# EAGLE design Rev1 (EAGLE 8.4.2)
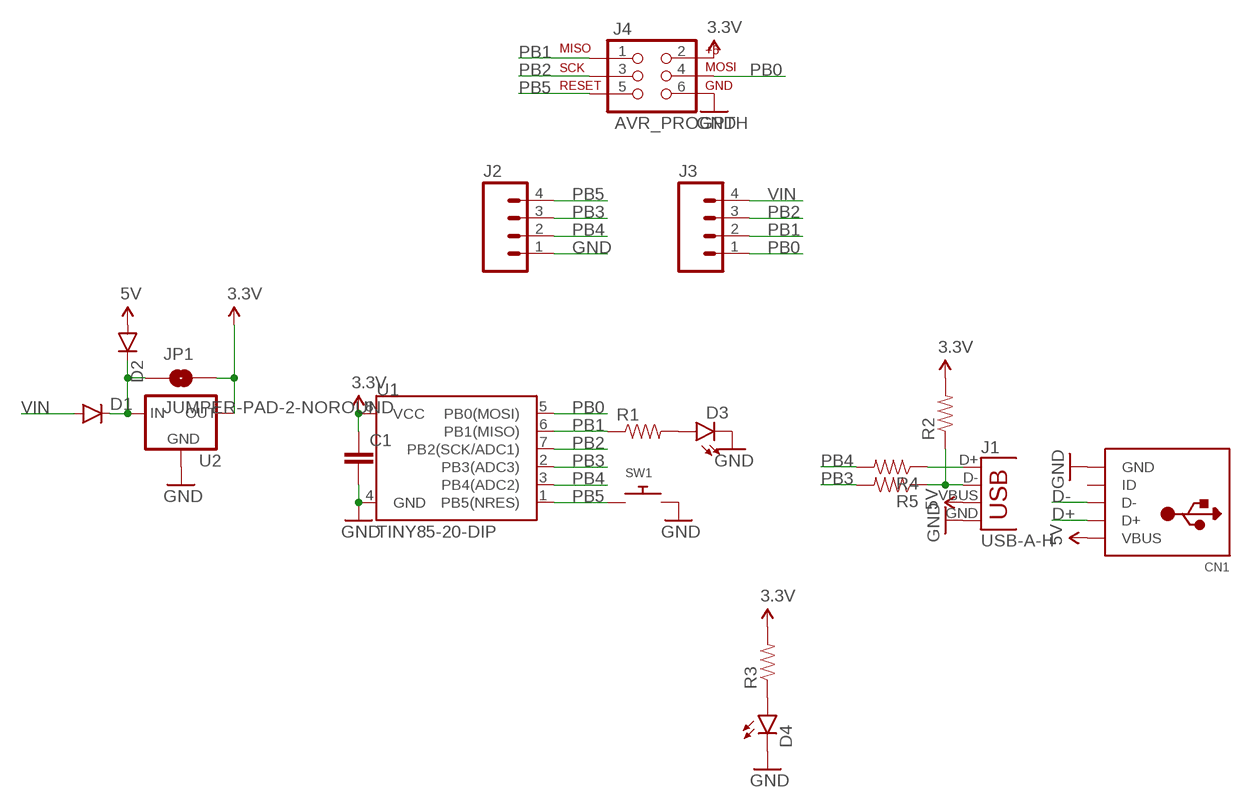
[diagram p0: schematic, sheet 1]

## Parts
C1  0.1UF-50V-20%(PTH)KIT-EZ  [CAP-PTH-SMALL-KIT]
CN1  USBTHM  [USB-MINIB-THM]
D1  DIODEPTH  [DIODE-1N4001]
D2  DIODEPTH  [DIODE-1N4001]
D3  LED3MM  [LED3MM]
D4  LED3MM  [LED3MM]
J1  USB-A-H  [USB-A-H]
J2  M04PTH  [1X04]
J3  M04PTH  [1X04]
J4  AVR_PROGPTH  [2X3]
JP1  JUMPER-PAD-2-NOROUND  [PAD-JUMPER-2-NO_YES_SILK_ROUND]
R1  RESISTORPTH-1/6W  [1/6W-RES]
R2  RESISTORPTH-1/6W  [1/6W-RES]
R3  RESISTORPTH-1/6W  [1/6W-RES]
R4  RESISTORPTH-1/6W  [1/6W-RES]
R5  RESISTORPTH-1/6W  [1/6W-RES]
SW1  SWITCH_PUSHBUTTONEVQ-PE  [TACT_PANA-EVQ]
U1  TINY85-20-DIP  ATTINY45TINY85-20-DIP  [DIP08]
U2  V_REG_78XXTO-92_UNTESTED  [TO-92]

## Nets
3.3V: C1.1 J4.2(VIN) JP1.2 R2.2 R3.2 U1.8(VCC) U2.1(OUT)
5V: CN1.VBUS D2.A J1.VBUS
D+: CN1.D+ J1.D+ R4.1
D-: CN1.D- J1.D- R2.1 R5.1
GND: C1.2 CN1.GND D3.K(C) D4.K(C) J1.GND J2.1 J4.6(GND) SW1.P$2 U1.4(GND) U2.2(GND)
N$1: D4.A R3.1
N$2: D3.A R1.2
N$3: D1.C D2.C JP1.1 U2.3(IN)
PB0: J3.1 J4.4(MOSI) U1.5(PB0(MOSI))
PB1: J3.2 J4.1(MISO) R1.1 U1.6(PB1(MISO))
PB2: J3.3 J4.3(SCK) U1.7(PB2(SCK/ADC1))
PB3: J2.3 R5.2 U1.2(PB3(ADC3))
PB4: J2.2 R4.2 U1.3(PB4(ADC2))
PB5: J2.4 J4.5(RESET) SW1.P$1 U1.1(PB5(NRES))
VIN: D1.A J3.4
Unconnected: CN1.ID

## Library data of the parts
C1 = SparkFun-Capacitors:0.1UF-50V-20%(PTH): CAP-08370; PROD_ID: CAP-08370
CN1 = adafruit:USB: USB Connectors USBMINIB - Surface Mount Female Mini-B USB Connector 4UConnector: 06564 By microbuilder.eu Thru-hole RA Female Mini-B USB Connector 4UConnector: 18732 By ladyada.net
D1 D2 = SparkFun-DiscreteSemi:DIODE: Diode These are standard reverse protection diodes and small signal diodes. SMA package can handle up to about 1A. SOD-323 can handle about 200mA. What the SOD-323 package when ordering, there are some mfgs out there that are 5-pin packages.
D3 D4 = SparkFun-LED:LED: LEDs Standard schematic elements and footprints for 5mm, 3mm, 1206, and 0603 sized LEDs. 5mm - Spark Fun Electronics SKU : COM-00529 (and others); PROD_ID: DIO-08794
J1 = SparkFun-Connectors:USB: USB Connectors USB-B-PTH is fully proven SKU : PRT-00139/CONN-08278 USB-miniB is fully proven SKU : PRT-00587 USB-A-PCB is untested. USB-A-H is throughly reviewed, but untested. Spark Fun Electronics SKU : PRT-00437 USB-B-SMT is throughly reviewed, but untested. Needs silkscreen touching up. USB-A-S has not been used/tested USB-MB-H has not been used/tested USB-MICROB has been used. CONN-09505; PROD_ID: CONN-08367
J2 J3 = SparkFun-Connectors:M04: Header 4 Standard 4-pin 0.1" header. Use with straight break away headers (SKU : PRT-00116), right angle break away headers (PRT-00553), swiss pins (PRT-00743), machine pins (PRT-00117), and female headers (PRT-00115). Molex polarized connector foot print use with SKU : PRT-08231 with associated crimp pins and housings. 1MM SMD Version SKU: PRT-10208; PROD_ID: CONN-09696
J4 = maxorig:AVR_PROG: AVR ISP 6 Pin This is the reduced ISP connector for AVR programming. Common on Arduino. This footprint will take up less PCB space and can be used with a 10-pin to 6-pin adapter such as SKU: BOB-08508 **Special note about "TEST_POINT" package. The stop mask is on the top side, so if you want your programming test points to be on the bottom of your board, make sure to place this package on the bottom side of the board. This also ensure that the orientation to program from the bottom side will be correct.
JP1 = SparkFun-Passives:JUMPER-PAD-2-NO
R1-R5 = SparkFun-Resistors:RESISTOR: Resistor Basic schematic elements and footprints for 0603, 1206, and PTH resistors.
SW1 = adafruit:SWITCH_PUSHBUTTON: Buttons SOFTTOUCHSMD_SJ - Soft touch temporary push button (Super Junk Akihabara) Compatible with SKPMANE010 [Mouser: 688-SKPMAN] C&K_KSS = Digikey: KSS221GLFS
U1 = SparkFun-DigitalIC:ATTINY45: Atmel 8-pin 2/4/8kB flash uC; PROD_ID: IC-09445
U2 = SparkFun-PowerIC:V_REG_78XX: Voltage Regulator Standard 78xx regulator. IGO (Input Ground Output). Spark Fun Electronics SKU : COM-00107

## Board
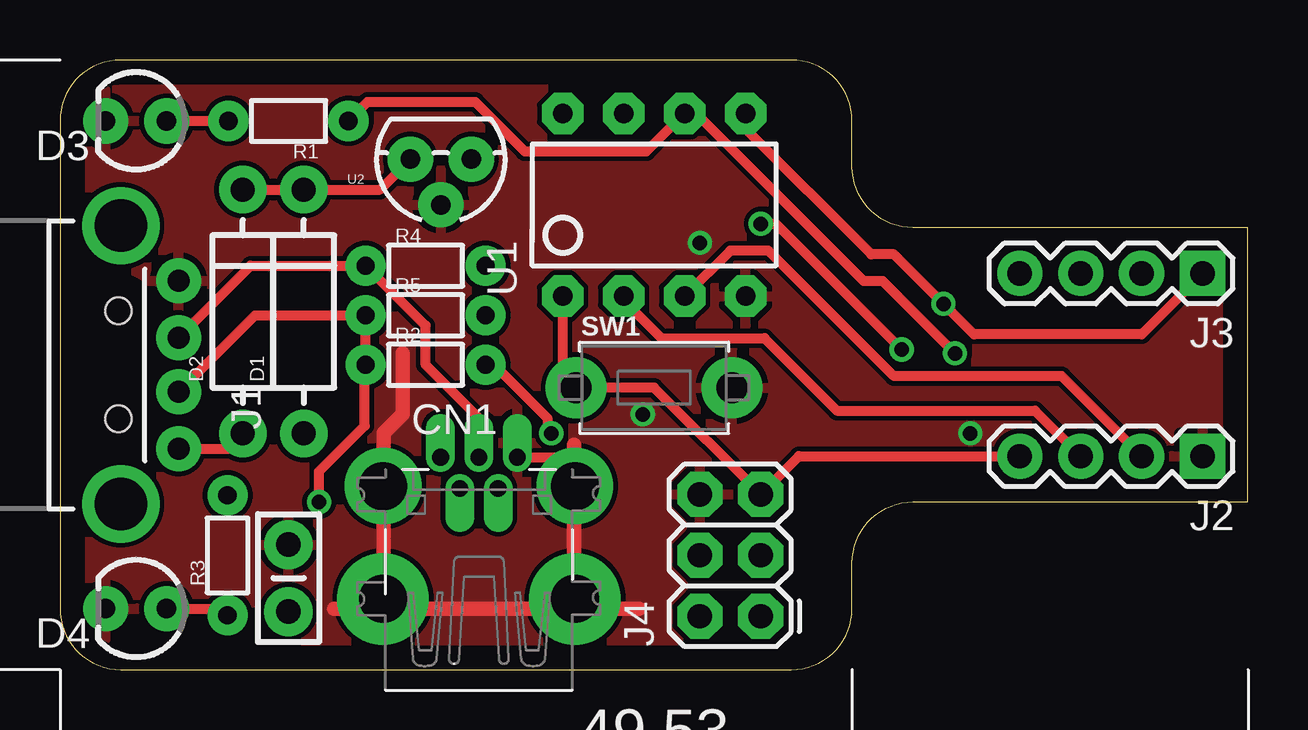
[diagram p1: board, top side]
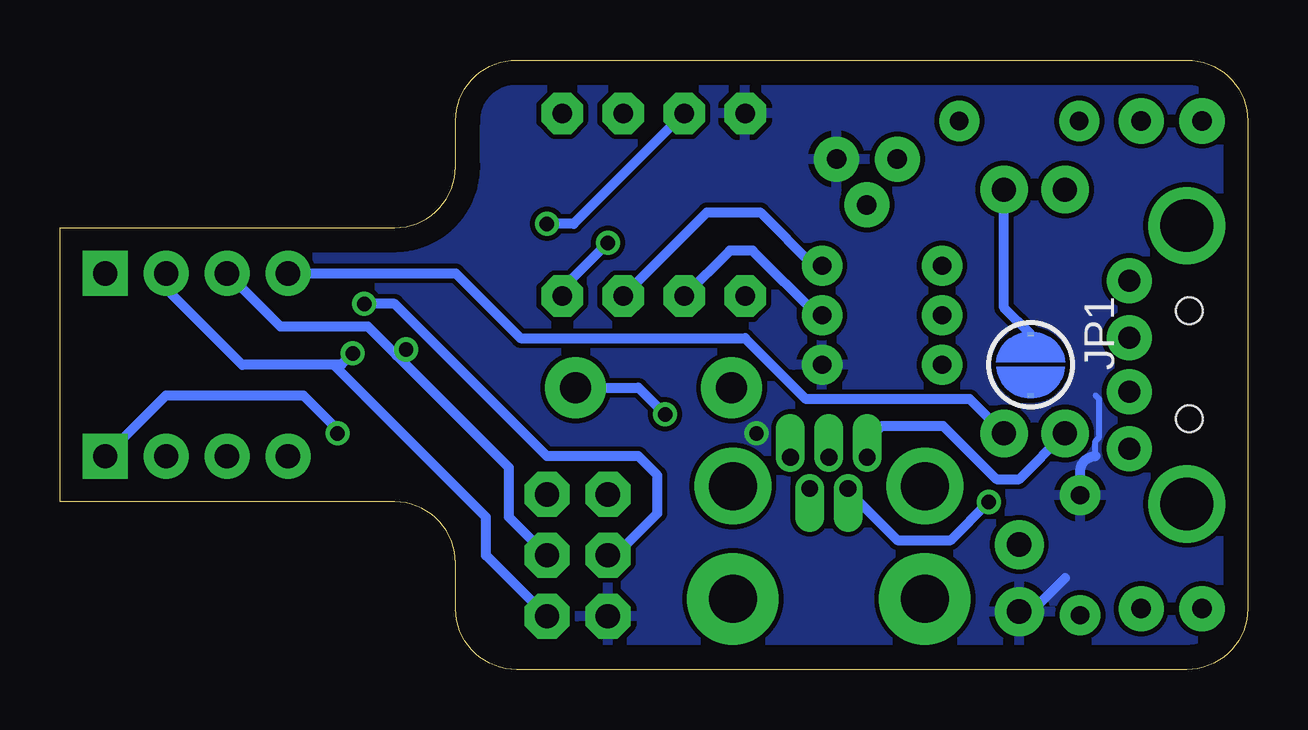
[diagram p2: board, bottom side, seen from below]

Size 49.51 x 25.4 mm. Coordinates in mm from the lower left corner, seen from the top.
Outline: 0,22.86 0,2.54 arc90 2.54,0 30.48,0 arc90 33.02,2.54 33.02,4.45 arc-90 35.56,6.99 49.51,6.99 49.51,18.41 35.56,18.41 arc-90 33.02,20.95 33.02,22.86 arc90 30.48,25.4 2.54,25.4 arc90 0,22.86
Copper layers (1*16): Top 0.035mm / dielectric 1.5mm / Bottom 0.035mm
Design rules "default": minimum track width 10mil, minimum drill 24mil, track to track 8mil, track to pad 8mil, pad to pad 8mil, via to via 8mil, smd to smd 8mil, copper to edge 40mil, drill to drill 8mil, minimum pad ring 10mil, minimum via ring 8mil, stop-mask expansion 4mil, vias tented up to drill 0mil, thermal gap 10mil

### Footprints (pad centres in the part's own frame; a part is rotated, then mirrored left to right if it is on the bottom)
CAP-PTH-SMALL-KIT = drill 1.016 pad 2.032: 1 -1.397,0; 2 1.397,0
USB-MINIB-THM = drill 0.7 offset: D+ 0,9.8; D- -0.8,8.5; GND 1.6,9.8; ID 0.8,8.5; VBUS -1.6,9.8 | drill 2 pad 3.81: GND1 -4,3.9; GND4 4,3.9 | drill 2 pad 3.2: GND2 -4,8.6; GND3 4,8.6
DIODE-1N4001 = drill 1 pad 1.981: A -5.08,0; C 5.08,0
LED3MM = drill 0.813 pad 1.88: A -1.27,0; K 1.27,0
USB-A-H = drill 0.914 pad 1.88: D+ 2.4,1.127; D- 2.4,-1.127; GND 2.4,3.5; VBUS 2.4,-3.5 | drill 2.2: GND2 0,-5.8; GND3 0,5.8 | hole 1.1: -0.1,2.25; -0.1,-2.25
1X04 = drill 1.016 pad 1.88 square: 1 0,0 | drill 1.016 pad 1.88: 2 2.54,0; 3 5.08,0; 4 7.62,0
2X3 = drill 1.016 pad 1.88 octagon: 1 0,0; 2 0,2.54; 3 2.54,0; 4 2.54,2.54; 5 5.08,0; 6 5.08,2.54
PAD-JUMPER-2-NO_YES_SILK_ROUND = smd 0.152 x 0.305: 1 -1.27,0; 2 1.27,0
1/6W-RES = drill 0.762 pad 1.676: 1 -2.5,0; 2 2.5,0
TACT_PANA-EVQ = drill 1.3 pad 2.54: P$1 -3.25,0; P$2 3.25,0
DIP08 = drill 0.813 pad 1.727 octagon: 1 -3.81,-3.81; 2 -1.27,-3.81; 3 1.27,-3.81; 4 3.81,-3.81; 5 3.81,3.81; 6 1.27,3.81; 7 -1.27,3.81; 8 -3.81,3.81
TO-92 = drill 0.813 pad 1.88: 1 -1.27,0; 2 0,1.905; 3 1.27,0

### Placement (x,y rotation side)
C1  9.53,3.81 90 top
CN1  17.46,-0.95 0 top
D1  10.16,14.92 90 top
D2  7.62,14.92 90 top
D3  3.17,22.86 180 top
D4  3.17,2.54 180 top
J1  2.54,12.7 0 top
J2  47.62,8.89 180 top
J3  47.62,16.51 180 top
J4  29.21,2.22 90 top
JP1  9.05,12.7 270 bottom
R1  9.53,22.86 180 top
R2  15.24,12.7 0 top
R3  6.99,4.76 90 top
R4  15.24,16.83 0 top
R5  15.24,14.76 0 top
SW1  24.77,11.75 0 top
U1  24.77,19.37 0 top
U2  15.88,21.27 180 top

### Tracks (layer width: path | path; a pad name or v marks a point on that pad's centre or on a via)
3.3V  (via drill 0.6)
  Top 0.406: R2.2 18.1,12.7 20.32,10.48 20.32,10 v20.48,9.84
  Bottom 0.254: 6.35,8.89 6.35,9.53 6.19,9.68 6.19,11.27 6.35,11.43
  Bottom 0.406: R3.2 6.99,8.26 arc90 6.35,8.89 | C1.1 9.02,2.41 7.62,3.81
  pour Bottom: 0,25.4 49.53,25.4 49.53,0 0,0
5V
  Top 0.406: J1.VBUS 6.98,9.2 D2.A
  Bottom 0.406: CN1.VBUS 15.86,9.54 15.24,10.16 12.7,10.16 10.48,7.94 9.53,7.94 D2.A
D+
  Top 0.406: CN1.D+ 17.46,10.48 15.24,12.7 15.24,14.33 R4.1 7.94,16.83 J1.D+
D-  (via drill 0.6)
  Top 0.406: J1.D- 8.13,14.76 R5.1 R2.1 12.7,12.66 12.7,10.16 10.79,8.26 v10.79,6.99
  Bottom 0.406: CN1.D- 16.66,7.46 14.61,5.4 12.38,5.4 v10.79,6.99
GND  (via drill 0.6)
  Top 0.406: CN1.GND 21.39,8.85 21.43,8.89
  Top 0.61: 13.49,5.56 13.49,9.84 14.29,10.64 14.29,13.18 | 11.43,2.54 13.49,2.54 | 13.49,2.54 21.43,2.54 | 21.43,2.54 24.13,2.54 | 13.49,5.4 13.49,2.54 | 21.43,2.54 21.43,8.89 21.43,9.37
  Bottom 0.406: J2.1 45.09,11.43 39.37,11.43 37.94,10 v37.94,9.84 | U1.4 28.57,15.88 v26.67,17.78 | SW1.P$2 25.4,11.75 v24.29,10.64
  pour Top: 49.53,25.4 0,25.4 0,0 49.53,0
N$1
  Top 0.406: D4.A 6.71,2.54 R3.1
N$2
  Top 0.406: D3.A R1.2
N$3
  Top 0.406: D2.C D1.C 13.34,20 U2.3
  Bottom 0.406: JP1.1 10.16,15.08 D1.C
PB0  (via drill 0.6)
  Top 0.406: J3.1 45.09,13.97 38.1,13.97 v36.83,15.24 34.77,17.3 33.81,17.3 28.57,22.54 U1.5 28.57,23.5
  Bottom 0.406: J4.4 26.35,4.76 24.61,6.51 24.61,8.1 25.4,8.89 29.21,8.89 35.56,15.24 v36.83,15.24
PB1  (via drill 0.6)
  Top 0.406: R1.1 12.82,23.65 17.3,23.65 19.37,21.59 24.45,21.59 U1.6 26.51,23.18 33.5,16.19 34.29,16.19 v37.31,13.18
  Bottom 0.406: J4.1 31.75,4.76 31.75,6.35 38.1,12.7 | 38.1,12.7 41.91,12.7 45.09,15.88 J3.2 | v37.31,13.18 37.78,12.7 38.1,12.7
PB2  (via drill 0.6)
  Top 0.406: v29.21,18.57 29.84,18.57 v35.08,13.34
  Bottom 0.406: J4.3 30.8,6.35 30.8,8.41 35.32,12.94 35.48,13.1 | 35.48,13.1 36.67,14.29 40.32,14.29 J3.3 | U1.7 28.1,18.57 v29.21,18.57 | v35.08,13.34 35.48,13.1
PB3
  Top 0.406: U1.2 23.5,15.4 25.08,13.81 29.37,13.81 32.38,10.79 40.64,10.79 J2.3
  Bottom 0.406: R5.2 17.94,14.76 20.64,17.46 21.59,17.46 U1.2
PB4
  Top 0.406: J2.2 41.75,12.22 34.77,12.22 29.53,17.46 27.94,17.46 U1.3
  Bottom 0.406: U1.3 22.54,19.05 20.32,19.05 18.1,16.83 R4.2
PB5
  Top 0.406: U1.1 20.95,12.31 SW1.P$1 24.77,11.75 J4.5 30.8,8.89 J2.4
VIN
  Bottom 0.406: D1.A 11.59,11.27 18.41,11.27 20.95,13.81 30.32,13.81 33.02,16.51 J3.4